# Altium schematic sheet Paralel NOR FLASH.SchDoc: Paralel NOR FLASH
size A4; SheetNumber: 3; SheetTotal: 11; SheetSize: A4
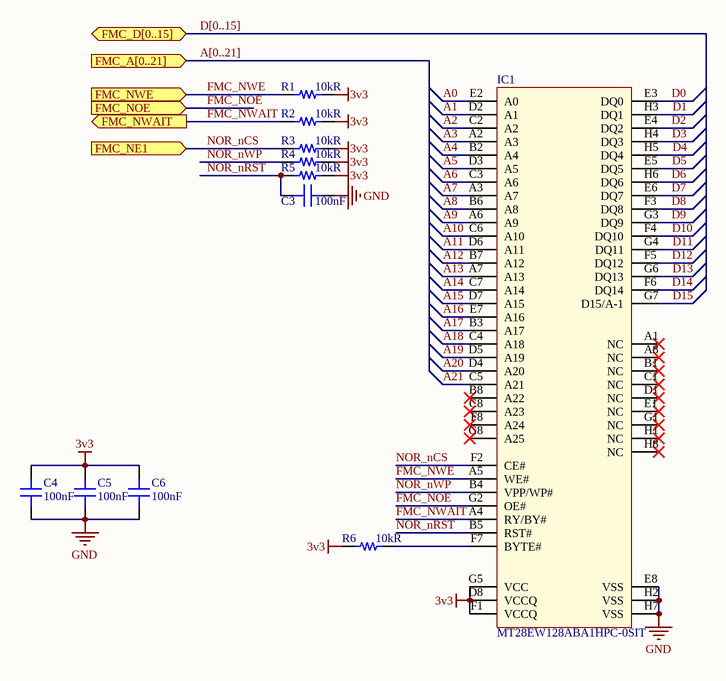
[diagram p0: Paralel NOR FLASH.SchDoc]

## Parts
C3  100nF  [CAP 0603/1608]
C4  100nF  [CAP 0603/1608]
C5  100nF  [CAP 0603/1608]
C6  100nF  [CAP 0603/1608]
IC1  MT28EW128ABA1HPC-0SIT  [MICRON LBGA-64 11X13mm]
R1  10kR  [RES 0603/1608]
R2  10kR  [RES 0603/1608]
R3  10kR  [RES 0603/1608]
R4  10kR  [RES 0603/1608]
R5  10kR  [RES 0603/1608]
R6  10kR  [RES 0603/1608]

## Ports
FMC_A[0..21] (in), FMC_D[0..15] (bidir), FMC_NE1 (in), FMC_NOE (in), FMC_NWAIT (out), FMC_NWE (in)

## Nets
3v3: C4.1 C5.1 C6.1 IC1.D8(VCCQ) IC1.F1(VCCQ) IC1.G5(VCC) R1.2 R2.2 R3.2 R4.2 R5.2 R6.1
GND: C3.2 C4.2 C5.2 C6.2 IC1.E8(VSS) IC1.H2(VSS) IC1.H7(VSS)
A0: IC1.E2(A0)
A1: IC1.D2(A1)
A2: IC1.C2(A2)
A3: IC1.A2(A3)
A4: IC1.B2(A4)
A5: IC1.D3(A5)
A6: IC1.C3(A6)
A7: IC1.A3(A7)
A8: IC1.B6(A8)
A9: IC1.A6(A9)
A10: IC1.C6(A10)
A11: IC1.D6(A11)
A12: IC1.B7(A12)
A13: IC1.A7(A13)
A14: IC1.C7(A14)
A15: IC1.D7(A15)
A16: IC1.E7(A16)
A17: IC1.B3(A17)
A18: IC1.C4(A18)
A19: IC1.D5(A19)
A20: IC1.D4(A20)
A21: IC1.C5(A21)
D0: IC1.E3(DQ0)
D1: IC1.H3(DQ1)
D2: IC1.E4(DQ2)
D3: IC1.H4(DQ3)
D4: IC1.H5(DQ4)
D5: IC1.E5(DQ5)
D6: IC1.H6(DQ6)
D7: IC1.E6(DQ7)
D8: IC1.F3(DQ8)
D9: IC1.G3(DQ9)
D10: IC1.F4(DQ10)
D11: IC1.G4(DQ11)
D12: IC1.F5(DQ12)
D13: IC1.G6(DQ13)
D14: IC1.F6(DQ14)
D15: IC1.G7(D15/A-1)
FMC_NOE: IC1.G2(OE#) ; port FMC_NOE
FMC_NWAIT: IC1.A4(RY/BY#) R2.1 ; port FMC_NWAIT
FMC_NWE: IC1.A5(WE#) R1.1 ; port FMC_NWE
NOR_nCS: IC1.F2(CE#) R3.1 ; port FMC_NE1
NOR_nRST: C3.1 IC1.B5(RST#) R5.1
NOR_nWP: IC1.B4(VPP/WP#) R4.1
NetIC1_F7: IC1.F7(BYTE#) R6.2

Not connected (* = marked no-connect by the designer): IC1 A1(NC)* A8(NC)* B1(NC)* B8(A22)* C1(NC)* C8(A23)* D1(NC)* E1(NC)* F8(A24)* G1(NC)* G8(A25)* H1(NC)* H8(NC)*

## Buses and harness runs
bus A[0..21] = port FMC_A[0..21]
bus D[0..15] = port FMC_D[0..15]

## Notes on the sheet
- Title:
- Size:
- Project:
- Revision:
- Sheet
- of
- Date:
- YıLDıZ IoT
- Elperek Mahallesi
- Saray Sokak, No:12
- SAKARYA / TURKEY
- File:

## Library data of the parts
C3-C6 = Capacitor - Ceramic: Ceramic, SMT Capacitor; Manufacturer: Samsung; Manufacturer Part Number: CL10B104JB8NNNC; Tolerance: 5%; Voltage Rating: 50V; Dielectric: X7R; Supplier 1: Digi-Key; Supplier Part Number 1: 1276-1033-1-ND; Stock 1: 305374; Pricing 1: 1 = 0,10000, 10 = 0,04800, 100 = 0,02160, 500 = 0,01540, 1000 = 0,01210 (USD); RoHS: Yes; Mount: Surface Mount; Case/Package: 0603; Case Code (Metric): 1608; Case Code (Imperial): 0603; Material: Ceramic; Contact Plating: Tin; Min Operating Temperature: -55°C; Max Operating Temperature: 125°C; Packaging: Tape and Reel; Package Quantity: 1; Capacitance: 100nF; Voltage: 50V; Length: 1.6mm; Height: 0.8mm; Width: 0.031inch; Thickness: 0.035inch; Depth: 0.8mm; Radiation Hardening: No; ComponentLink1URL: https://datasheet.ciiva.com/25793/cl10b104jb8nnnc-25793394.pdf?src-supplier=Digi-Key; ComponentLink1Description: https://datasheet.ciiva.com/25793/cl10b104jb8nnnc-25793394.pdf?src-supplier=Digi-Key; ComponentLink2URL: https://datasheet.ciiva.com/26838/getdatasheetpartid-359321-26838402.pdf?src-supplier=Verical; ComponentLink2Description: https://datasheet.ciiva.com/26838/getdatasheetpartid-359321-26838402.pdf?src-supplier=Verical; ComponentLink3URL: https://datasheet.ciiva.com/16498/cl10b104jb8nnnc-16498485.pdf?src-supplier=Future+Electronics; ComponentLink3Description: https://datasheet.ciiva.com/16498/cl10b104jb8nnnc-16498485.pdf?src-supplier=Future+Electronics; ComponentLink4URL: https://datasheet.ciiva.com/29199/456613-da-01-en-vs-kondensator-0603-29199008.pdf?src-supplier=Conrad; ComponentLink4Description: https://datasheet.ciiva.com/29199/456613-da-01-en-vs-kondensator-0603-29199008.pdf?src-supplier=Conrad
IC1 = MICRON MT28EW128: Parallel NOR Flash Embedded Memory; Manufacturer: Micron Technology; Memory Type: Non-Volatile,FLASH; Memory Size: 128Mb; Access Time: 95ns; Supplier 1: Digi-Key; Supplier Part Number 1: 557-1777-ND; Manufacturer Part Number: MT28EW128ABA1HPC-0SIT; Stock 1: 1436; Pricing 1: 1 = 3,60000, 10 = 3,26400, 25 = 3,19320, 50 = 3,17540, 100 = 2,84780, 250 = 2,83716, 500 = 2,73266, 1000 = 2,59806 (USD); RoHS: Yes; Mount: Surface Mount; Number of Pins: 64; Min Operating Temperature: -40°C; Max Operating Temperature: 85°C; Packaging: Tray; ComponentLink1URL: https://www.micron.com/~/media/documents/products/data-sheet/nor-flash/parallel/mt28ew_mt28fw/mt28ew_qlhp_128_aba_0sit.pdf?src-supplier=Digi-Key; ComponentLink1Description: https://www.micron.com/~/media/documents/products/data-sheet/nor-flash/parallel/mt28ew_mt28fw/mt28ew_qlhp_128_aba_0sit.pdf?src-supplier=Digi-Key
R1-R6 = Resistor_Chip: Ceramic, SMT Capacitor; Manufacturer: Stackpole Electronics; Manufacturer Part Number: RNCP0603FTD10K0; Tolerance: 1%; Max Power Dissipation: 125mW; Temperature Coefficient: 100ppm/°C; Supplier 1: Digi-Key; Supplier Part Number 1: RNCP0603FTD10K0CT-ND; Stock 1: 619664; Pricing 1: 1 = 0,10000, 10 = 0,06700, 100 = 0,02730, 1000 = 0,01224, 2500 = 0,01063 (USD); RoHS: Yes; Mount: Surface Mount; Case/Package: 0603; Case Code (Metric): 1608; Case Code (Imperial): 0603; Contact Plating: Tin,Matte; Min Operating Temperature: -55°C; Max Operating Temperature: 155°C; Packaging: Tape and Reel; Resistance: 10kR; Composition: Thin Film; Number of Terminations: 2; Features: Moisture Resistant,Anti-Sulfur; Length: 0.059inch; Height: 0.02inch; Width: 0.031inch; Radiation Hardening: No; Lead Free: Lead Free; ComponentLink1URL: https://www.seielect.com/Catalog/SEI-rncp.pdf?src-supplier=Avnet; ComponentLink1Description: https://www.seielect.com/Catalog/SEI-rncp.pdf?src-supplier=Avnet; ComponentLink2URL: https://www.seielect.com/catalog/SEI-Packaging.pdf?src-supplier=Digi-Key; ComponentLink2Description: https://www.seielect.com/catalog/SEI-Packaging.pdf?src-supplier=Digi-Key; ComponentLink3URL: https://www.seielect.com/Catalog/SEI-rncp.pdf?src-supplier=Digi-Key; ComponentLink3Description: https://www.seielect.com/Catalog/SEI-rncp.pdf?src-supplier=Digi-Key